# EAGLE design vv_mod_v1 (EAGLE 5.11)
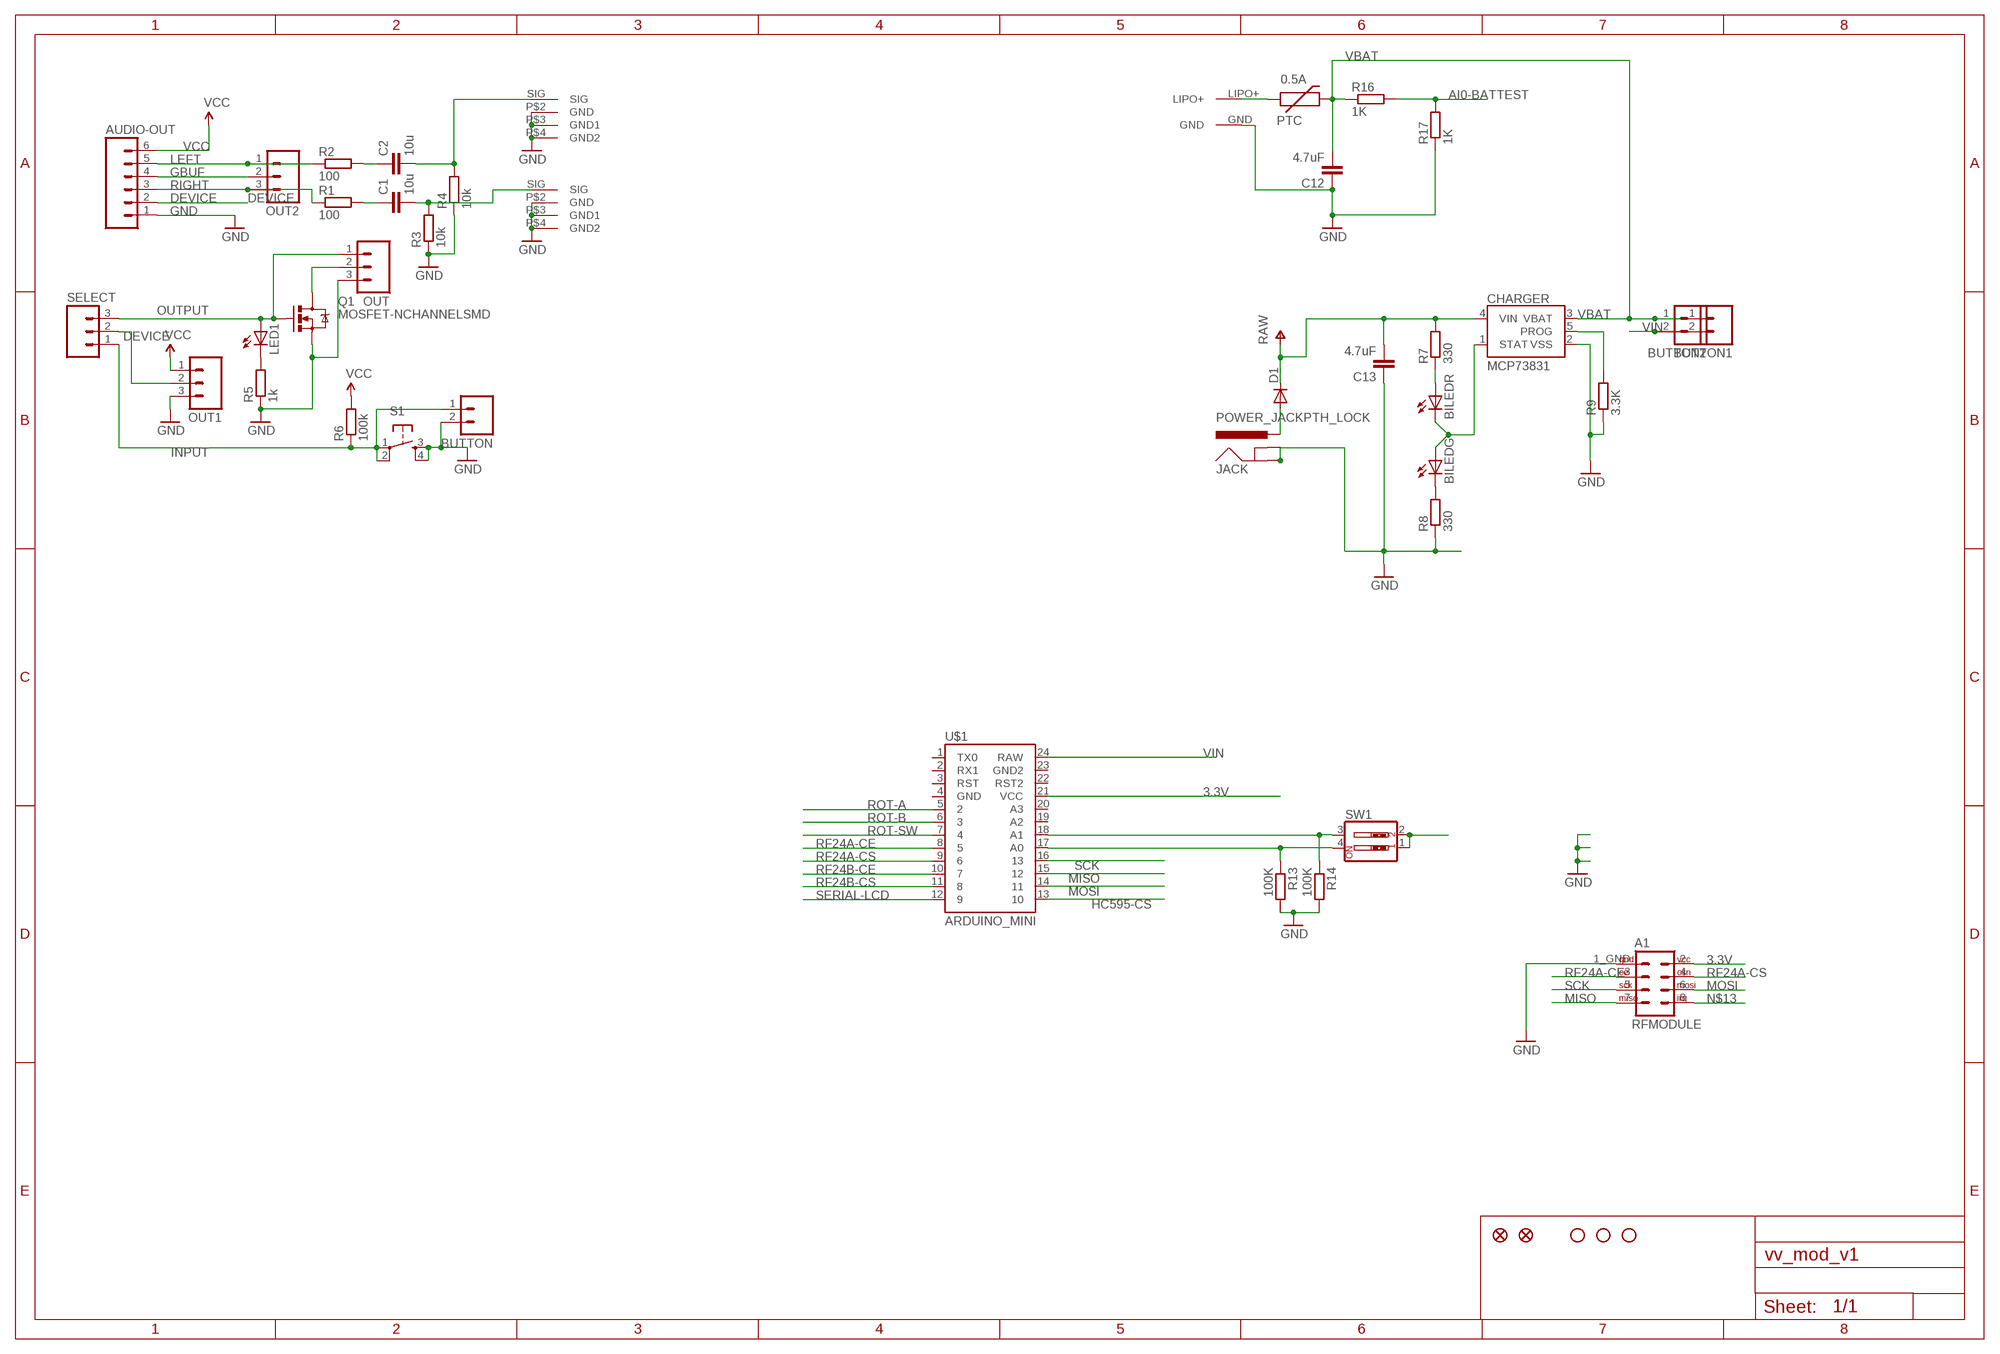
[diagram p0: schematic, sheet 1]

## Parts
0.5A  PTC  [PTC-1210]
A1  RFMODULE  [2X5_RFMODULE]
AUDIO-OUT  M06LOCK  [1X06_LOCK]
BILED  BILED  [2XLED]
BUTTON  M02PTH  [1X02]
BUTTON1  M02PTH  [1X02]
BUTTON2  M02PTH  [1X02]
C1  10u  C-EUC1206  [C1206]
C2  10u  C-EUC1206  [C1206]
C12  4.7uF  C-EUC0603  [C0603]
C13  4.7uF  C-EUC0603  [C0603]
CHARGER  MCP73831  [SOT23-5]
D1  DIODESMA-KIT  [SMA-DIODE-KIT]
JACK  POWER_JACKPTH_LOCK  [POWER_JACK_PTH_LOCK]
JP2  FIDUCIAL1X2.5  [FIDUCIAL-1X2.5]
JP3  FIDUCIAL1X2.5  [FIDUCIAL-1X2.5]
JP4  STAND-OFF  [STAND-OFF]
JP5  STAND-OFF  [STAND-OFF]
JP6  STAND-OFF  [STAND-OFF]
LED1  LEDCHIP-LED0805  [CHIP-LED0805]
LEFT  RCA901RADIOSPARE  [RCA_901]
OUT  M03LOCK  [1X03_LOCK]
OUT1  M03LOCK  [1X03_LOCK]
OUT2  M03LOCK  [1X03_LOCK]
Q1  MOSFET-NCHANNELSMD  [SOT23-3]
R1  100  R-EU_R1206  [R1206]
R2  100  R-EU_R1206  [R1206]
R3  10k  R-EU_R0603  [R0603]
R4  10k  R-EU_R0603  [R0603]
R5  1k  R-EU_R0603  [R0603]
R6  100k  R-EU_R0805  [R0805]
R7  330  R-EU_R0805  [R0805]
R8  330  R-EU_R0805  [R0805]
R9  3.3K  R-EU_R0603  [R0603]
R13  100K  R-EU_R0805  [R0805]
R14  100K  R-EU_R0805  [R0805]
R16  1K  R-EU_R0603  [R0603]
R17  1K  R-EU_R0603  [R0603]
RIGHT  RCA901RADIOSPARE  [RCA_901]
S1  TAC_SWITCHPTH  [TACTILE-PTH]
SELECT  M03LOCK  [1X03_LOCK]
SW1  SW_DIP-2  [DIPSWITCH-02]
U$1  ARDUINO_MINI  [ARDUINO_MINI]
U$8  LIPO_PAD  [2X1_LIPO_PAD]

## Nets
3.3V: A1.2(VCC) U$1.21(VCC)
AI0-BATTEST: R16.2 R17.2
AI1-TYPE: R14.1 SW1.3 U$1.18(A1)
AI2-TEST: R13.1 SW1.4 U$1.17(A0)
DEVICE: AUDIO-OUT.2 OUT1.2 SELECT.2
GBUF: AUDIO-OUT.4 OUT2.2
GND [GND]: A1.1_GND(GND) AUDIO-OUT.1 BUTTON.2 C12.1 C13.1 CHARGER.2(VSS) JACK.GND JACK.GNDBREAK LEFT.P$2(GND) LEFT.P$3(GND1) LEFT.P$4(GND2) OUT1.3 OUT.3 Q1.2(S) R3.1 R4.1 R5.1 R8.1 R9.1 R13.2 R14.2 R17.1 RIGHT.P$2(GND) RIGHT.P$3(GND1) RIGHT.P$4(GND2) S1.3 S1.4 U$8.GND
HC595-CS: U$1.13
INPUT: BUTTON.1 R6.1 S1.1 S1.2 SELECT.1
LEFT: AUDIO-OUT.5 OUT2.1 R2.1
MISO: A1.7(MISO) U$1.15
MOSI: A1.6(MOSI) U$1.14
N$1: C1.1 R1.2
N$2: C2.1 R2.2
N$3: C1.2 R3.2 RIGHT.SIG
N$4: C2.2 LEFT.SIG R4.2
N$5: LED1.C R5.2
N$6: OUT.2 Q1.3(D)
N$8: SW1.1 SW1.2
N$10: D1.A JACK.PWR
N$13: A1.8(IRQ)
N$20: BILED.A2(R:A) R7.1
N$22: BILED.C3(G:C) R8.2
N$24: CHARGER.5(PROG) R9.2
OUTPUT: LED1.A OUT.1 Q1.1(G) SELECT.3
RAW: C13.2 CHARGER.4(VIN) D1.C R7.2
RF24A-CE: A1.3(CE) U$1.8
RF24A-CS: A1.4(CSN) U$1.9
RF24B-CE: U$1.10
RF24B-CS: U$1.11
RIGHT: AUDIO-OUT.3 OUT2.3 R1.1
ROT-A: U$1.5
ROT-B: U$1.6
ROT-SW: U$1.7
SCK: A1.5(SCK) U$1.16
SERIAL-LCD: U$1.12
STAT: BILED.A1(G:A) BILED.C4(R:C) CHARGER.1(STAT)
VBAT: 0.5A.2 BUTTON1.1 BUTTON2.1 C12.2 CHARGER.3(VBAT) R16.1
VBAT-RAW: 0.5A.1 U$8.LIPO+
VCC [3.3V]: AUDIO-OUT.6 OUT1.1 R6.2
VIN: BUTTON1.2 BUTTON2.2 U$1.24(RAW)
Unconnected: U$1.1(TX0) U$1.2(RX1) U$1.3(RST) U$1.4(GND) U$1.19(A2) U$1.20(A3) U$1.22(RST2) U$1.23(GND2)

## Library data of the parts
0.5A = pierre_vv:PTC
A1 = pierre_vv:RFMODULE
AUDIO-OUT = SparkFun:M06: Header 6 Standard 6-pin 0.1" header. Use with straight break away headers (SKU : PRT-00116), right angle break away headers (PRT-00553), swiss pins (PRT-00743), machine pins (PRT-00117), and female headers (PRT-00115). Molex polarized connector foot print use with SKU : PRT-08094 with associated crimp pins and housings. NOTES ON THE VARIANTS LOCK and LOCK_LONGPADS... This footprint was designed to help hold the alignment of a through-hole component (i.e. 6-pin header) while soldering it into place. You may notice that each hole has been shifted either up or down by 0.005 of an inch from it's more standard position (which is a perfectly straight line). This slight alteration caused the pins (the squares in the middle) to touch the edges of the holes. Because they are alternating, it causes a "brace" to hold the component in place. 0.005 has proven to be the perfect amount of "off-center" position when using our standard breakaway headers. Although looks a little odd when you look at the bare footprint, once you have a header in there, the alteration is very hard to notice. Also, if you push a header all the way into place, it is covered up entirely on the bottom side. This idea of altering the position of holes to aid alignment will be further integrated into the Sparkfun Library for other footprints. It can help hold any component with 3 or more connection pins.
BILED = pierre_vv:BILED
BUTTON BUTTON1 BUTTON2 = SparkFun:M02: Header 2 Standard 2-pin 0.1" header. Use with straight break away headers (SKU : PRT-00116), right angle break away headers (PRT-00553), swiss pins (PRT-00743), machine pins (PRT-00117), and female headers (PRT-00115). Molex polarized connector foot print use with SKU : PRT-08233 with associated crimp pins and housings.
C1 C2 C12 C13 = rcl:C-EU: CAPACITOR, European symbol
CHARGER = SparkFun:MCP73831: Microchip's MCP73831 Miniature single cell, fully integrated Li-Ion, Li-polymer charge management controller http://ww1.microchip.com/downloads/en/DeviceDoc/21984a.pdf
D1 = SparkFun:DIODE: Diode These are standard reverse protection diodes and small signal diodes. SMA package can handle up to about 1A. SOD-323 can handle about 200mA. What the SOD-323 package when ordering, there are some mfgs out there that are 5-pin packages.
JACK = SparkFun:POWER_JACK: Power Jack This is the standard 5.5mm barrel jack for power. The PTH is the most common, proven, reliable, footprint. All others are experimental. The Slot footprint only works if the mill layer is transmitted to the PCB fab house so be warned. Spark Fun Electronics SKU : PRT-00119. Mating wall wart : TOL-00298 (and others)
JP2 JP3 = SparkFun:FIDUCIAL: Fiducial Alignment Points Various fiducial points for machine vision alignment.
JP4-JP6 = SparkFun:STAND-OFF: Stand Off This is the mechanical footprint for a #4 phillips button head screw. Use the keepout ring to avoid running the screw head into surrounding components. SKU : PRT-00447
LED1 = led:LED: LED OSRAM: - CHIPLED LG R971, LG N971, LY N971, LG Q971, LY Q971, LO R971, LY R971 LH N974, LH R974 LS Q976, LO Q976, LY Q976 LO Q996 - Hyper CHIPLED LW Q18S LB Q993, LB Q99A, LB R99A - SideLED LS A670, LO A670, LY A670, LG A670, LP A670 LB A673, LV A673, LT A673, LW A673 LH A674 LY A675 LS A676, LA A676, LO A676, LY A676, LW A676 LS A679, LY A679, LG A679 - Hyper Micro SIDELED® LS Y876, LA Y876, LO Y876, LY Y876 LT Y87S - SmartLED LW L88C, LW L88S LB L89C, LB L89S, LG L890 LS L89K, LO L89K, LY L89K LS L896, LA L896, LO L896, LY L896 - TOPLED LS T670, LO T670, LY T670, LG T670, LP T670 LSG T670, LSP T670, LSY T670, LOP T670, LYG T670 LG T671, LOG T671, LSG T671 LB T673, LV T673, LT T673, LW T673 LH T674 LS T676, LA T676, LO T676, LY T676, LB T676, LH T676, LSB T676, LW T676 LB T67C, LV T67C, LT T67C, LS T67K, LO T67K, LY T67K, LW E67C LS E67B, LA E67B, LO E67B, LY E67B, LB E67C, LV E67C, LT E67C LW T67C LS T679, LY T679, LG T679 LS T770, LO T770, LY T770, LG T770, LP T770 LB T773, LV T773, LT T773, LW T773 LH T774 LS E675, LA E675, LY E675, LS T675 LS T776, LA T776, LO T776, LY T776, LB T776 LHGB T686 LT T68C, LB T68C - Hyper Mini TOPLED® LB M676 - Mini TOPLED Santana® LG M470 LS M47K, LO M47K, LY M47K Source: http://www.osram.convergy.de LUXEON: - LUMILED® LXK2-PW12-R00, LXK2-PW12-S00, LXK2-PW14-U00, LXK2-PW14-V00 LXK2-PM12-R00, LXK2-PM12-S00, LXK2-PM14-U00 LXK2-PE12-Q00, LXK2-PE12-R00, LXK2-PE12-S00, LXK2-PE14-T00, LXK2-PE14-U00 LXK2-PB12-K00, LXK2-PB12-L00, LXK2-PB12-M00, LXK2-PB14-N00, LXK2-PB14-P00, LXK2-PB14-Q00 LXK2-PR12-L00, LXK2-PR12-M00, LXK2-PR14-Q00, LXK2-PR14-R00 LXK2-PD12-Q00, LXK2-PD12-R00, LXK2-PD12-S00 LXK2-PH12-R00, LXK2-PH12-S00 LXK2-PL12-P00, LXK2-PL12-Q00, LXK2-PL12-R00 Source: www.luxeon.com KINGBRIGHT: KA-3528ASYC Source: www.kingbright.com
LEFT RIGHT = pierre_vv:RCA
OUT OUT1 OUT2 SELECT = SparkFun:M03: Header 3 Standard 3-pin 0.1" header. Use with straight break away headers (SKU : PRT-00116), right angle break away headers (PRT-00553), swiss pins (PRT-00743), machine pins (PRT-00117), and female headers (PRT-00115). Molex polarized connector foot print use with SKU : PRT-08232 with associated crimp pins and housings.
Q1 = SparkFun:MOSFET-NCHANNEL
R1-R9 R13 R14 R16 R17 = rcl:R-EU_: RESISTOR, European symbol
S1 = SparkFun:TAC_SWITCH: Momentary Switch Button commonly used for reset or general input. Spark Fun Electronics SKU : COM-00097
SW1 = SparkFun:SW_DIP-2: DIP SWITCH
U$1 = SparkFun:ARDUINO_MINI
U$8 = pierre_vv:LIPO_PAD

## Net classes
0 default: width 0.203 mm
1 GND: width 0.254 mm
2 3.3V: width 0.254 mm

## Board
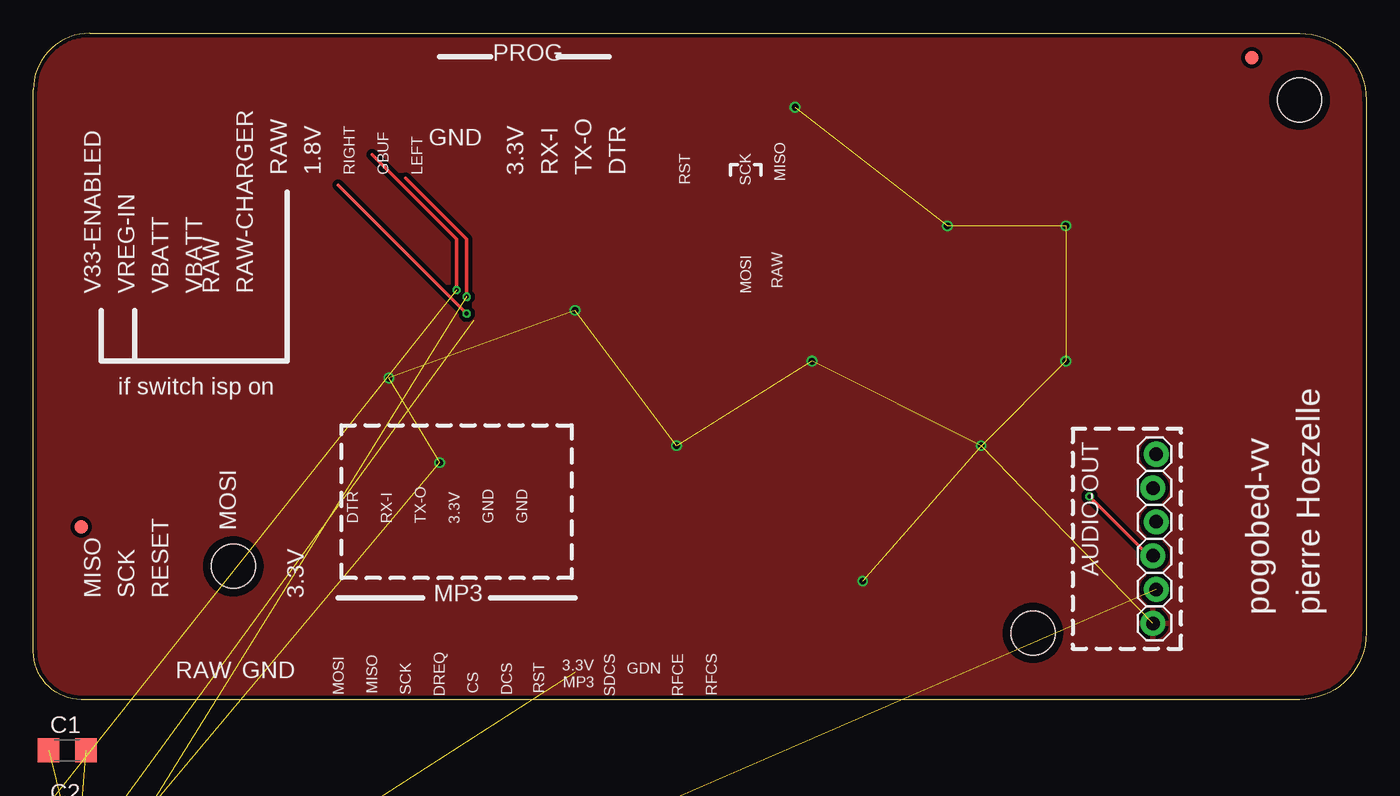
[diagram p1: board, top side]
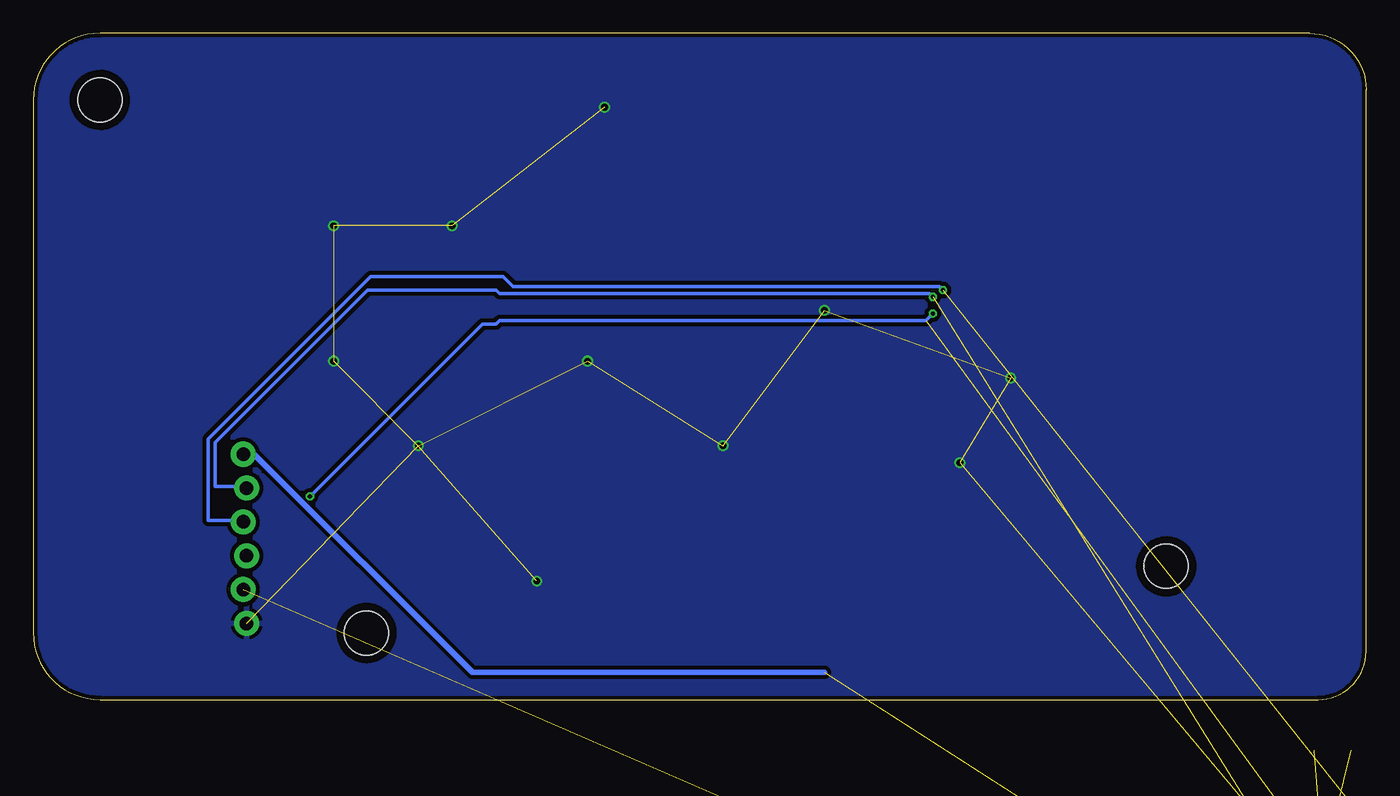
[diagram p2: board, bottom side, seen from below]

Size 100 x 50 mm. Coordinates in mm from the lower left corner, seen from the top.
Outline: 4.24,50 arc90 0,45.76 0,3.61 arc90 3.61,0 95,0 arc90 100,5 100,45 arc90 95,50 4.24,50
Copper layers (1*16): Top 0.035mm / dielectric 1.5mm / Bottom 0.035mm
Design rules "Fusion_eagle_rule_v1.1": minimum track width 6mil, minimum drill 12mil, track to track 6mil, track to pad 6mil, pad to pad 6mil, via to via 6mil, smd to smd 0mil, copper to edge 10mil, drill to drill 10mil, minimum pad ring 10mil, minimum via ring 6mil, stop-mask expansion 2mil, vias tented up to drill 100mil, thermal gap 10mil

### Footprints (pad centres in the part's own frame; a part is rotated, then mirrored left to right if it is on the bottom)
PTC-1210 = smd 1 x 2.5: 1 -1.5,0; 2 1.5,0
2X5_RFMODULE = drill 0.9 pad 1.88 square: 1_GND 1.397,-1.27 | drill 0.9 pad 1.88 octagon: 2 3.937,-1.27; 3 1.143,-3.81; 5 1.397,-6.35; 6 3.937,-6.35; 7 1.143,-8.89; 8 3.683,-8.89 | drill 0.8 pad 1.88 octagon: 4 3.683,-3.81 | hole 1.1: 1.27,-11.43; 3.81,-11.43
1X06_LOCK = drill 1.016 pad 1.88 round: 1 0,0; 2 2.54,-0.254; 3 5.08,0; 4 7.62,-0.254; 5 10.16,0; 6 12.7,-0.254
2XLED = smd 1.5 x 1: A1 1.75,-0.7; A2 1.75,0.7; C3 -1.75,-0.7; C4 -1.75,0.7
1X02 = drill 1.016 pad 1.88 round: 1 0,0; 2 2.54,0
C1206 = smd 1.6 x 1.8: 1 -1.4,0; 2 1.4,0
C0603 = smd 1.1 x 1: 1 -0.85,0; 2 0.85,0
SOT23-5 = smd 0.55 x 1.2: 1 -0.95,-1.3; 2 0,-1.3; 3 0.95,-1.3; 4 0.95,1.3; 5 -0.95,1.3
SMA-DIODE-KIT = smd 1.77 x 1.47: A -2.4,0; C 2.4,0
POWER_JACK_PTH_LOCK = drill 2.997 pad 4.115 round: GND 0.025,6.557; GNDBREAK 3.762,10.7 | drill 3.2 pad 4.115 round: PWR 0,13.878
FIDUCIAL-1X2.5 = smd 1 x 1: 1 0,0
STAND-OFF = hole 3.302: 0,0
CHIP-LED0805 = smd 1.2 x 1.2: A 0,-1.05; C 0,1.05
RCA_901 = drill 1.6 long: P$2 -5.08,0; P$3 5.08,0; P$4 0,-5.08 | drill 1.6 round: SIG 0,0
1X03_LOCK = drill 1.016 pad 1.88 round: 1 0,0.127; 2 2.54,-0.127; 3 5.08,0.127
SOT23-3 = smd 0.8 x 0.9: 1 -0.95,-1; 2 0.95,-1; 3 0,1.1
R1206 = smd 1.6 x 1.803: 1 -1.422,0; 2 1.422,0
R0603 = smd 1 x 1.1: 1 -0.85,0; 2 0.85,0
R0805 = smd 1.3 x 1.5: 1 -0.95,0; 2 0.95,0
TACTILE-PTH = drill 1.016 pad 1.88 round: 1 -3.251,2.261; 2 3.251,2.261; 3 -3.251,-2.261; 4 3.251,-2.261
DIPSWITCH-02 = drill 0.813 long: 1 -1.27,-3.81; 2 1.27,-3.81; 3 1.27,3.81; 4 -1.27,3.81
ARDUINO_MINI = drill 1.016 pad 1.88 round: 1 -7.62,12.7; 2 -7.62,10.16; 3 -7.62,7.62; 4 -7.62,5.08; 5 -7.62,2.54; 6 -7.62,0; 7 -7.62,-2.54; 8 -7.62,-5.08; 9 -7.62,-7.62; 10 -7.62,-10.16; 11 -7.62,-12.7; 12 -7.62,-15.24; 13 7.62,-15.24; 14 7.62,-12.7; 15 7.62,-10.16; 16 7.62,-7.62; 17 7.62,-5.08; 18 7.62,-2.54; 19 7.62,0; 20 7.62,2.54; 21 7.62,5.08; 22 7.62,7.62; 23 7.62,10.16; 24 7.62,12.7
2X1_LIPO_PAD = smd 5.08 x 2.54 bottom: GND -3.81,1.27; LIPO+ -3.81,-8.89

### Placement (x,y rotation side)
0.5A  -99.06,-111.76 0 top  (outside the outline)
A1  -106.68,-129.54 0 top  (outside the outline)
AUDIO-OUT  84,5.71 90 top
BILED  -100.33,-105.41 0 top  (outside the outline)
BUTTON  -50.8,-57.15 0 top  (outside the outline)
BUTTON1  -106.68,-118.11 0 top  (outside the outline)
BUTTON2  -106.68,-124.46 0 top  (outside the outline)
C1  2.54,-3.81 0 top  (outside the outline)
C2  2.54,-8.89 0 top  (outside the outline)
C12  -95.25,-105.41 0 top  (outside the outline)
C13  -87.63,-105.41 0 top  (outside the outline)
CHARGER  -106.68,-106.68 0 top  (outside the outline)
D1  -81.28,-111.76 0 top  (outside the outline)
JACK  -102.87,-88.9 0 top  (outside the outline)
JP2  91.41,48.16 0 top
JP3  3.59,12.97 0 top
JP4  15,10 0 top
JP5  75,5 90 top
JP6  95,45 0 top
LED1  -31.75,-36.83 0 top  (outside the outline)
LEFT  -7.62,-21.59 0 top  (outside the outline)
OUT  -40.64,-44.45 0 top  (outside the outline)
OUT1  -50.8,-63.5 0 top  (outside the outline)
OUT2  -50.8,-69.85 0 top  (outside the outline)
Q1  -41.91,-38.1 0 top  (outside the outline)
R1  2.54,-15.24 0 top  (outside the outline)
R2  2.54,-20.32 0 top  (outside the outline)
R3  1.27,-26.67 0 top  (outside the outline)
R4  1.27,-31.75 0 top  (outside the outline)
R5  -38.1,-36.83 0 top  (outside the outline)
R6  -40.64,-49.53 0 top  (outside the outline)
R7  -88.9,-93.98 0 top  (outside the outline)
R8  -82.55,-93.98 0 top  (outside the outline)
R9  -106.68,-111.76 0 top  (outside the outline)
R13  -105.41,-162.56 0 top  (outside the outline)
R14  -97.79,-162.56 0 top  (outside the outline)
R16  -93.98,-111.76 0 top  (outside the outline)
R17  -88.9,-111.76 0 top  (outside the outline)
RIGHT  -21.59,-21.59 0 top  (outside the outline)
S1  -48.26,-48.26 0 top  (outside the outline)
SELECT  -25.4,-38.1 0 top  (outside the outline)
SW1  -104.14,-152.4 0 top  (outside the outline)
U$1  -119.38,-148.59 0 top  (outside the outline)
U$8  -81.28,-74.93 0 top  (outside the outline)

### Tracks (layer width: path | path; a pad name or v marks a point on that pad's centre or on a via)
3.3V  (1 unrouted)
AI0-BATTEST  (1 unrouted)
AI1-TYPE  (2 unrouted)
AI2-TEST  (2 unrouted)
DEVICE  (2 unrouted)
GBUF  (via drill 0.3)  (1 unrouted)
  Top 0.254: 25.4,40.89 31.75,34.54 v31.75,30.73
  Bottom 0.254: v31.75,30.73 32,30.99 64.01,30.99 64.77,31.75 74.68,31.75 86.87,19.56 86.87,13.46 84.33,13.46 AUDIO-OUT.4
GND  (via drill 0.5)  (38 unrouted)
  other vias: 26.67,24.13 68.58,35.56 77.47,35.56 77.47,25.4 71.12,19.05 48.26,19.05 57.15,44.45 58.42,25.4 30.48,17.78 40.64,29.21 62.23,8.89
  pour Top (isolate 0.305): 0,0 41.1,0 41.1,-0.03 100,-0.03 100,50 47.73,50 31.27,50 0,50
  pour Bottom (isolate 0.305): 0,0 100,0 100,50 47.73,50 31.27,50 0,50
INPUT  (4 unrouted)
LEFT  (via drill 0.3)  (2 unrouted)
  Top 0.254: 27.94,39.12 32.51,34.54 v32.51,30.23
  Bottom 0.254: v32.51,30.23 32.77,30.48 65.02,30.48 65.28,30.73 74.93,30.73 86.36,19.3 86.36,16 84.07,16 AUDIO-OUT.5
MISO  (1 unrouted)
MOSI  (1 unrouted)
N$1  (1 unrouted)
N$2  (1 unrouted)
N$3  (2 unrouted)
N$4  (2 unrouted)
N$5  (1 unrouted)
N$6  (1 unrouted)
N$8  (1 unrouted)
N$10  (1 unrouted)
N$20  (1 unrouted)
N$22  (1 unrouted)
N$24  (1 unrouted)
OUTPUT  (3 unrouted)
RAW  (3 unrouted)
RF24A-CE  (1 unrouted)
RF24A-CS  (1 unrouted)
RIGHT  (via drill 0.3)  (2 unrouted)
  Top 0.254: v32.51,28.96 22.86,38.61 | v79.25,15.24 83.82,10.67 AUDIO-OUT.3
  Bottom 0.254: v32.51,28.96 33.02,28.45 65.02,28.45 65.28,28.19 66.29,28.19 v79.25,15.24
SCK  (1 unrouted)
STAT  (2 unrouted)
VBAT  (5 unrouted)
VBAT-RAW  (1 unrouted)
VCC  (2 unrouted)
  Bottom 0.406: 40.64,2.03 67.06,2.03 83.57,18.54 84.07,18.54 AUDIO-OUT.6
VIN  (2 unrouted)

### Text on the board
tNames: PROG | GND | RAW | 1.8V | RIGHT | GBUF | LEFT | 3.3V | RX-I | TX-O | DTR | RST | SCK | MISO | RAW | V33-ENABLED | VREG-IN | VBATT | VBATT | RAW | RAW-CHARGER | MOSI | if switch isp on | MOSI | DTR | RX-I | TX-O | 3.3V | GND | GND | MISO | SCK | RESET | 3.3V | MP3 | pogobed-vv | pierre Hoezelle | RAW | GND | GDN | 3.3V | MP3 | MOSI | MISO | SCK | DREQ | CS | DCS | RST | SDCS | RFCE | RFCS
tValues: GND | 3.3V | left | gbuf | right | device | GND